# EAGLE schematic uArm_back_print (EAGLE 9.5.1)
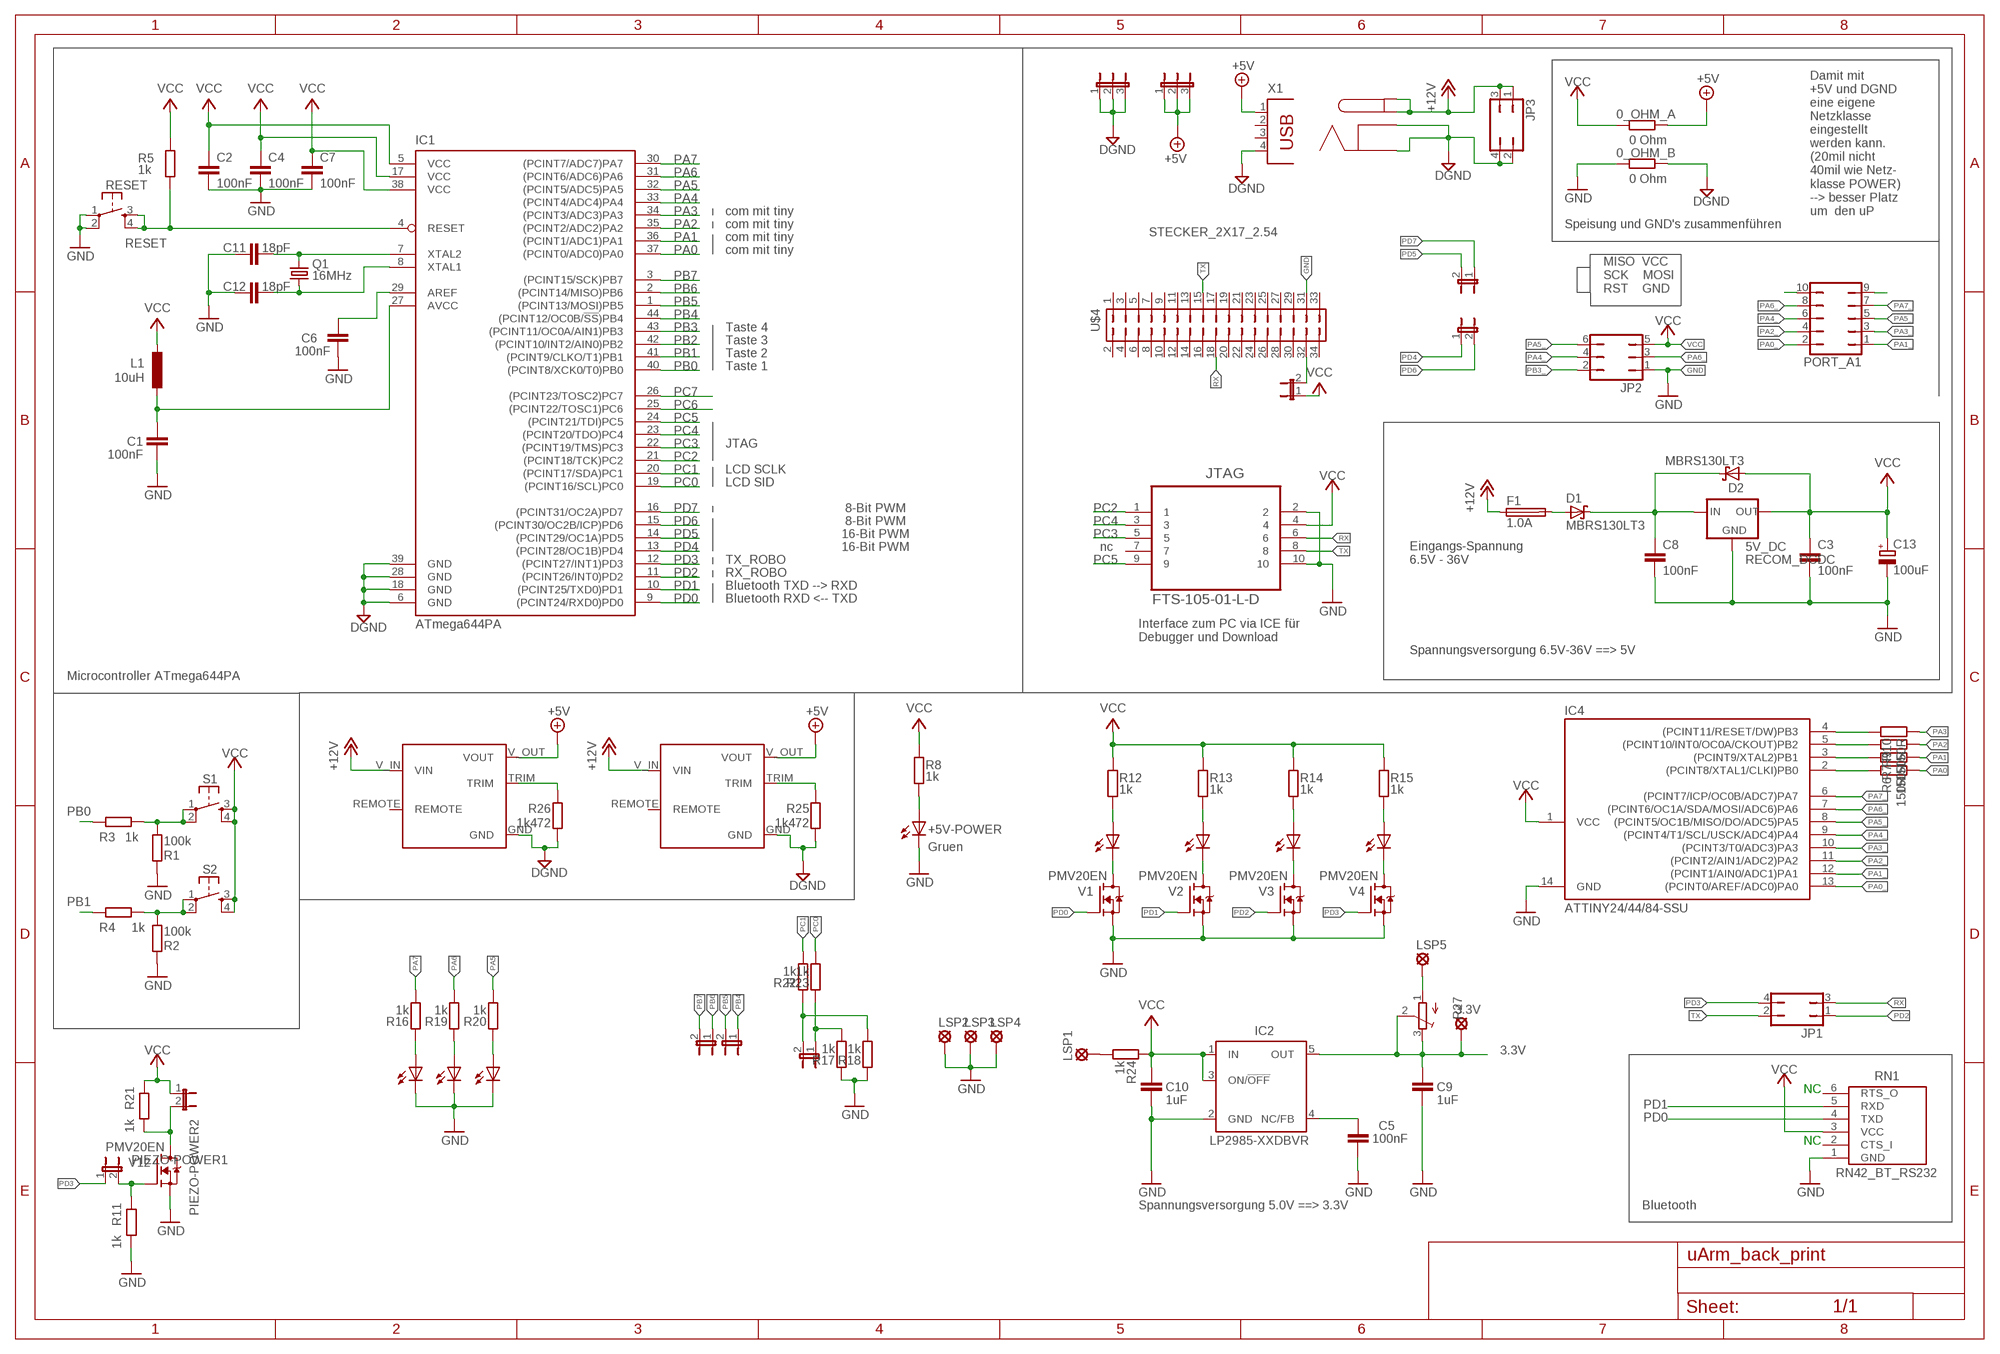
[diagram p0: schematic, sheet 1]

## Parts
0_OHM_A  0 Ohm  R-EU_R0805  [R0805]
0_OHM_B  0 Ohm  R-EU_R0805  [R0805]
3.3V  3.3V  LSP11  [LSP11]
5V_DC  RECOM_DCDC  [RECOM_DCDC]
+5V-POWER  Gruen  LEDCHIPLED_1206  [CHIPLED_1206]
C1  100nF  C-EUC0805  [C0805]
C2  100nF  C-EUC0805  [C0805]
C3  100nF  C-EUC0805  [C0805]
C4  100nF  C-EUC0805  [C0805]
C5  100nF  C-EUC0805  [C0805]
C6  100nF  C-EUC0805  [C0805]
C7  100nF  C-EUC0805  [C0805]
C8  100nF  C-EUC0805  [C0805]
C9  1uF  C-EUC0805  [C0805]
C10  1uF  C-EUC0805  [C0805]
C11  18pF  C-EUC0805  [C0805]
C12  18pF  C-EUC0805  [C0805]
C13  100uF  CPOL-EUUD-6,3X8,8  [UD-6,3X5,8_NICHICON]
D1  MBRS130LT3  [SMB]
D2  MBRS130LT3  [SMB]
F1  1.0A  195601206  [F1206]
IC1  ATmega644PA  ATMEGA644A  [TQFP44]
IC2  LP2985-XXDBVR  [SOT23-DBV]
IC4  ATTINY24/44/84-SSU  [SOIC14]
JP1  JP2Q  [JP2Q]
JP2  JP3Q  [JP3Q]
JP3  JP2Q  [JP2Q]
JTAG  FTS-105-01-L-D  [SAMTEC_FTS-105-01-L-D]
L1  10uH  L-EUL2825P  [L2825P]
LSP1  LSP11  [LSP11]
LSP2  LSP11  [LSP11]
LSP3  LSP11  [LSP11]
LSP4  LSP11  [LSP11]
LSP5  LSP11  [LSP11]
PIEZO-POWER1  JP1E  [JP1]
PIEZO-POWER2  JP1E  [JP1]
PIEZO-POWER3  JP1E  [JP1]
PIEZO-POWER4  JP1E  [JP1]
PIEZO-POWER5  JP1E  [JP1]
PIEZO-POWER8  JP1E  [JP1]
PIEZO-POWER9  JP1E  [JP1]
PIEZO-POWER10  JP1E  [JP1]
PORT_A1  JP5Q  [JP5Q]
Q1  16MHz  CRYSTALHC49UP  [HC49UP]
R1  100k  R-EU_R0805  [R0805]
R2  100k  R-EU_R0805  [R0805]
R3  1k  R-EU_R0805  [R0805]
R4  1k  R-EU_R0805  [R0805]
R5  1k  R-EU_R0805  [R0805]
R6  150R  R-EU_R0805  [R0805]
R7  150R  R-EU_R0805  [R0805]
R8  1k  R-EU_R0805  [R0805]
R9  150R  R-EU_R0805  [R0805]
R10  150R  R-EU_R0805  [R0805]
R11  1k  R-EU_R0805  [R0805]
R12  1k  R-EU_R0805  [R0805]
R13  1k  R-EU_R0805  [R0805]
R14  1k  R-EU_R0805  [R0805]
R15  1k  R-EU_R0805  [R0805]
R16  1k  R-EU_R0805  [R0805]
R17  1k  R-EU_R0805  [R0805]
R18  1k  R-EU_R0805  [R0805]
R19  1k  R-EU_R0805  [R0805]
R20  1k  R-EU_R0805  [R0805]
R21  1k  R-EU_R0805  [R0805]
R22  1k  R-EU_R0805  [R0805]
R23  1k  R-EU_R0805  [R0805]
R24  1k  R-EU_R0805  [R0805]
R25  1k472  R-EU_R0805  [R0805]
R26  1k472  R-EU_R0805  [R0805]
R27  TRIM_EU-3223G  [3223G]
RESET  TS42_4PAD  [TS42_4PAD]
RN1  RN42_BT_RS232  [RN42BT_RS232]
RX1  Gruen  LEDCHIPLED_1206  [CHIPLED_1206]
RX2  Gruen  LEDCHIPLED_1206  [CHIPLED_1206]
S1  TS42_4PAD  [TS42_4PAD]
S2  TS42_4PAD  [TS42_4PAD]
TX1  Gruen  LEDCHIPLED_1206  [CHIPLED_1206]
TX2  Gruen  LEDCHIPLED_1206  [CHIPLED_1206]
TX3  Gruen  LEDCHIPLED_1206  [CHIPLED_1206]
TX4  Gruen  LEDCHIPLED_1206  [CHIPLED_1206]
TX5  Gruen  LEDCHIPLED_1206  [CHIPLED_1206]
U$1  BUCHSE  [BUCHSE]
U$2  DCDC  [1X2,3_2.54MM]
U$3  DCDC  [1X2,3_2.54MM]
U$4  STECKER_2X17_2.54  [2X17_2.54]
UART_ROBO1  JP2E  [JP2]
UART_ROBO2  JP2E  [JP2]
V1  PMV20EN  BSS138  [SOT23]
V2  PMV20EN  BSS138  [SOT23]
V3  PMV20EN  BSS138  [SOT23]
V4  PMV20EN  BSS138  [SOT23]
V12  PMV20EN  BSS138  [SOT23]
X1  PN87520  [PN87520]

## Nets
3.3V: 3.3V.MP C9.1 IC2.5(OUT) R27.2(S) R27.3(E)
+5V: 0_OHM_A.2 U$2.V_OUT(VOUT) U$3.V_OUT(VOUT) UART_ROBO1.1 UART_ROBO1.2 UART_ROBO1.3 X1.1
+12V: F1.1 JP3.1 JP3.3 U$1.3 U$1.3.1 U$2.V_IN(VIN) U$3.V_IN(VIN)
DGND: 0_OHM_B.2 IC1.6(GND) IC1.18(GND) IC1.28(GND) IC1.39(GND) JP3.2 JP3.4 R25.1 R26.1 U$1.1 U$1.2 U$2.GND U$3.GND UART_ROBO2.1 UART_ROBO2.2 UART_ROBO2.3 X1.4
GND: 0_OHM_B.1 5V_DC.GND +5V-POWER.C C1.1 C2.2 C3.2 C4.2 C5.2 C6.1 C7.2 C8.2 C9.2 C10.2 C11.1 C12.2 C13.- IC2.2(GND) IC4.14(GND) JP2.1 JTAG.2 JTAG.10 LSP2.MP LSP3.MP LSP4.MP R1.1 R2.1 R11.2 R17.2 R18.2 RESET.1 RESET.2 RN1.1(GND) TX3.C TX4.C TX5.C U$4.31 V1.2(S) V2.2(S) V3.2(S) V4.2(S) V12.2(S)
N$1: PIEZO-POWER4.2 U$4.32
N$2: TX1.C V2.3(D)
N$3: RX1.C V1.3(D)
N$4: R13.1 TX1.A
N$5: R12.1 RX1.A
N$6: R16.2 TX5.A
N$7: R19.2 TX4.A
N$8: RX2.C V4.3(D)
N$9 [POWER]: D1.A F1.2
N$10: R15.1 RX2.A
N$11: R14.1 TX2.A
N$12: TX2.C V3.3(D)
N$13: R20.2 TX3.A
N$14: PIEZO-POWER10.2 R18.1 R22.2
N$15: PIEZO-POWER10.1 R17.1 R23.2
N$16: R26.2 U$3.TRIM
N$17: LSP5.MP R27.1(A)
N$18: LSP1.MP R24.1
N$21: R1.2 R3.2 S1.1 S1.2
N$22: R2.2 R4.2 S2.1 S2.2
N$27: PORT_A1.9
N$28: PORT_A1.10
N$35: C1.2 IC1.27(AVCC) L1.2
N$36: C12.1 IC1.8(XTAL1) Q1.1
N$37: C11.2 IC1.7(XTAL2) Q1.2
N$38: C6.2 IC1.29(AREF)
N$46: PIEZO-POWER2.2 R21.2 V12.3(D)
N$60: +5V-POWER.A R8.1
N$70: C5.1 IC2.4(NC/FB)
N$75 [POWER]: 5V_DC.IN C8.1 D1.C D2.C
N$85: R25.2 U$2.TRIM
PA0: IC1.37((PCINT0/ADC0)PA0) R6.1
PA0_: IC4.13((PCINT0/AREF/ADC0)PA0) PORT_A1.2
PA1: IC1.36((PCINT1/ADC1)PA1) R7.1
PA1_: IC4.12((PCINT1/AIN0/ADC1)PA1) PORT_A1.1
PA2: IC1.35((PCINT2/ADC2)PA2) R9.1
PA2_: IC4.11((PCINT2/AIN1/ADC2)PA2) PORT_A1.4
PA3: IC1.34((PCINT3/ADC3)PA3) R10.1
PA3_: IC4.10((PCINT3/T0/ADC3)PA3) PORT_A1.3
PA4: IC1.33((PCINT4/ADC4)PA4)
PA4_: IC4.9((PCINT4/T1/SCL/USCK/ADC4)PA4) JP2.4 PORT_A1.6
PA5: IC1.32((PCINT5/ADC5)PA5) R20.1
PA5_: IC4.8((PCINT5/OC1B/MISO/DO/ADC5)PA5) JP2.6 PORT_A1.5
PA6: IC1.31((PCINT6/ADC6)PA6) R19.1
PA6_: IC4.7((PCINT6/OC1A/SDA/MOSI/ADC6)PA6) JP2.3 PORT_A1.8
PA7: IC1.30((PCINT7/ADC7)PA7) R16.1
PA7_: IC4.6((PCINT7/ICP/OC0B/ADC7)PA7) PORT_A1.7
PB0: IC1.40((PCINT8/XCK0/T0)PB0) R3.1
PB0_: IC4.2((PCINT8/XTAL1/CLKI)PB0) R6.2
PB1: IC1.41((PCINT9/CLKO/T1)PB1) R4.1
PB1_: IC4.3((PCINT9/XTAL2)PB1) R7.2
PB2: IC1.42((PCINT10/INT2/AIN0)PB2)
PB2_: IC4.5((PCINT10/INT0/OC0A/CKOUT)PB2) R9.2
PB3: IC1.43((PCINT11/OC0A/AIN1)PB3)
PB3_: IC4.4((PCINT11/RESET/DW)PB3) JP2.2 R10.2
PB4: IC1.44((PCINT12/OC0B/!SS!)PB4) PIEZO-POWER9.1
PB5: IC1.1((PCINT13/MOSI)PB5) PIEZO-POWER9.2
PB6: IC1.2((PCINT14/MISO)PB6) PIEZO-POWER8.1
PB7: IC1.3((PCINT15/SCK)PB7) PIEZO-POWER8.2
PC0: IC1.19((PCINT16/SCL)PC0) R23.1
PC1: IC1.20((PCINT17/SDA)PC1) R22.1
PC2: IC1.21((PCINT18/TCK)PC2) JTAG.1
PC3: IC1.22((PCINT19/TMS)PC3) JTAG.5
PC4: IC1.23((PCINT20/TDO)PC4) JTAG.3
PC5: IC1.24((PCINT21/TDI)PC5) JTAG.9
PC6: IC1.25((PCINT22/TOSC1)PC6)
PC7: IC1.26((PCINT23/TOSC2)PC7)
PD0: IC1.9((PCINT24/RXD0)PD0) RN1.4(TXD) V1.1(G)
PD1: IC1.10((PCINT25/TXD0)PD1) RN1.5(RXD) V2.1(G)
PD2: IC1.11((PCINT26/INT0)PD2) JP1.1 V3.1(G)
PD3: IC1.12((PCINT27/INT1)PD3) JP1.4 PIEZO-POWER1.1 V4.1(G)
PD4: IC1.13((PCINT28/OC1B)PD4) PIEZO-POWER3.1
PD5: IC1.14((PCINT29/OC1A)PD5) PIEZO-POWER5.2
PD6: IC1.15((PCINT30/OC2B/ICP)PD6) PIEZO-POWER3.2
PD7: IC1.16((PCINT31/OC2A)PD7) PIEZO-POWER5.1
PD8: PIEZO-POWER1.2 R11.1 V12.1(G)
RESET: IC1.4(RESET) R5.1 RESET.3 RESET.4
RX: JP1.3 JTAG.6 U$4.18
TX: JP1.2 JTAG.8 U$4.15
VCC: 0_OHM_A.1 5V_DC.OUT C2.1 C3.1 C4.1 C7.1 C10.1 C13.+ D2.A IC1.5(VCC) IC1.17(VCC) IC1.38(VCC) IC2.1(IN) IC2.3(ON/!OFF) IC4.1(VCC) JP2.5 JTAG.4 L1.1 PIEZO-POWER2.1 PIEZO-POWER4.1 R5.2 R8.2 R12.2 R13.2 R14.2 R15.2 R21.1 R24.2 RN1.3(VCC) S1.3 S1.4 S2.3 S2.4
Unconnected: JTAG.7 RN1.2(CTS_I) RN1.6(RTS_O) U$2.REMOTE U$3.REMOTE U$4.1 U$4.2 U$4.3 U$4.4 U$4.5 U$4.6 U$4.7 U$4.8 U$4.9 U$4.10 U$4.11 U$4.12 U$4.13 U$4.14 U$4.16 U$4.17 U$4.19 U$4.20 U$4.21 U$4.22 U$4.23 U$4.24 U$4.25 U$4.26 U$4.27 U$4.28 U$4.29 U$4.30 U$4.33 U$4.34 X1.2 X1.3

## Notes on the sheet
- com mit tiny
- Damit mit
  +5V und DGND
  eine eigene 
  Netzklasse
  eingestellt
  werden kann.
  (20mil nicht
  40mil wie Netz-
  klasse POWER)
  --> besser Platz 
  um  den uP
- com mit tiny | Speisung und GND's zusammenführen
- com mit tiny
- com mit tiny
- MISO  VCC
  SCK    MOSI
  RST    GND
- Taste 4
- Taste 3
- Taste 2
- Taste 1
- JTAG
- LCD SCLK
- LCD SID
- 8-Bit PWM
- 8-Bit PWM
- 16-Bit PWM
- 16-Bit PWM | nc
- TX_ROBO
- Eingangs-Spannung
  6.5V - 36V
- RX_ROBO
- Bluetooth TXD --> RXD
- Bluetooth RXD <-- TXD
- Interface zum PC via ICE für
  Debugger und Download
- Spannungsversorgung 6.5V-36V ==> 5V
- Microcontroller ATmega644PA
- NC
- NC
- Spannungsversorgung 5.0V ==> 3.3V | Bluetooth

## Library data of the parts
0_OHM_A 0_OHM_B R1-R26 = rcl:R-EU_: RESISTOR, European symbol; SPICEPREFIX: R
3.3V LSP1-LSP5 = solpad:LSP11: SOLDER PAD drill 1.1 mm
5V_DC = DCDC:RECOM_DCDC
+5V-POWER RX1 RX2 TX1-TX5 = led:LED: LED OSRAM: - CHIPLED LG R971, LG N971, LY N971, LG Q971, LY Q971, LO R971, LY R971 LH N974, LH R974 LS Q976, LO Q976, LY Q976 LO Q996 - Hyper CHIPLED LW Q18S LB Q993, LB Q99A, LB R99A - SideLED LS A670, LO A670, LY A670, LG A670, LP A670 LB A673, LV A673, LT A673, LW A673 LH A674 LY A675 LS A676, LA A676, LO A676, LY A676, LW A676 LS A679, LY A679, LG A679 - Hyper Micro SIDELED® LS Y876, LA Y876, LO Y876, LY Y876 LT Y87S - SmartLED LW L88C, LW L88S LB L89C, LB L89S, LG L890 LS L89K, LO L89K, LY L89K LS L896, LA L896, LO L896, LY L896 - TOPLED LS T670, LO T670, LY T670, LG T670, LP T670 LSG T670, LSP T670, LSY T670, LOP T670, LYG T670 LG T671, LOG T671, LSG T671 LB T673, LV T673, LT T673, LW T673 LH T674 LS T676, LA T676, LO T676, LY T676, LB T676, LH T676, LSB T676, LW T676 LB T67C, LV T67C, LT T67C, LS T67K, LO T67K, LY T67K, LW E67C LS E67B, LA E67B, LO E67B, LY E67B, LB E67C, LV E67C, LT E67C LW T67C LS T679, LY T679, LG T679 LS T770, LO T770, LY T770, LG T770, LP T770 LB T773, LV T773, LT T773, LW T773 LH T774 LS E675, LA E675, LY E675, LS T675 LS T776, LA T776, LO T776, LY T776, LB T776 LHGB T686 LT T68C, LB T68C - Hyper Mini TOPLED® LB M676 - Mini TOPLED Santana® LG M470 LS M47K, LO M47K, LY M47K Source: http://www.osram.convergy.de LUXEON: - LUMILED® LXK2-PW12-R00, LXK2-PW12-S00, LXK2-PW14-U00, LXK2-PW14-V00 LXK2-PM12-R00, LXK2-PM12-S00, LXK2-PM14-U00 LXK2-PE12-Q00, LXK2-PE12-R00, LXK2-PE12-S00, LXK2-PE14-T00, LXK2-PE14-U00 LXK2-PB12-K00, LXK2-PB12-L00, LXK2-PB12-M00, LXK2-PB14-N00, LXK2-PB14-P00, LXK2-PB14-Q00 LXK2-PR12-L00, LXK2-PR12-M00, LXK2-PR14-Q00, LXK2-PR14-R00 LXK2-PD12-Q00, LXK2-PD12-R00, LXK2-PD12-S00 LXK2-PH12-R00, LXK2-PH12-S00 LXK2-PL12-P00, LXK2-PL12-Q00, LXK2-PL12-R00 Source: www.luxeon.com KINGBRIGHT: KA-3528ASYC Source: www.kingbright.com
C1-C12 = rcl:C-EU: CAPACITOR, European symbol; SPICEPREFIX: C
C13 = rcl2:CPOL-EU: POLARIZED CAPACITOR, European symbol
D1 D2 = diode:MBRS130LT3: Schottky Power Rectifier Source: http://www.onsemi.com/pub/Collateral/MBRS130LT3-D.PDF
F1 = fuse:19560: FUSE HOLDER TR5, Wickmann
IC1 = atmel:ATMEGA644: 8-bit Microcontroller with 64K Bytes In-System Programmable Flash Source: http://www.atmel.com/dyn/resources/prod_documents/doc2593.pdf; MPN: ATMEGA644PV-10AU; OC_FARNELL: 1455123; OC_NEWARK: 58M3748
IC2 = SmartPrj:LP2985-XXDBVR: ULTRALOW-POWER 50-mA LOW-DROPOUT LINEAR REGULATORS 50-mA Low-Dropout Regulator Source: http://focus.ti.com/lit/ds/symlink/tps77001.pdf
IC4 = attiny24_44_84:ATTINY24/44/84
JP1 JP3 = jumper:JP2Q: JUMPER
JP2 = jumper:JP3Q: JUMPER
JTAG = JTAG_10pol_50mil:FTS-105-01-L-D; DESCRIPTION: CONN HEADER, 1.27MM, THRU HOLE, 10WAY; MPN: FTS-105-01-L-D; OCFARNELL: 1667728; OCNEWARK: 11P4652; PACKAGE: HEADER, 1.27MM, THRU HOLE, 10WAY; SUPPLIER: Samtec
L1 = rcl:L-EU: INDUCTOR, European symbol
PIEZO-POWER1-PIEZO-POWER5 PIEZO-POWER8-PIEZO-POWER10 = jumper:JP1E: JUMPER
PORT_A1 = jumper:JP5Q: JUMPER
Q1 = crystal:CRYSTAL: CRYSTAL; OC_FARNELL: unknown; OC_NEWARK: unknown
R27 = pot:TRIM_EU-: POTENTIOMETER
RESET S1 S2 = SmartPrj:TS42_4PAD
RN1 = RN42_BT_RS232:RN42_BT_RS232
U$1 = untitled:BUCHSE
U$2 U$3 = untitled:DCDC
U$4 = untitled:STECKER_2X17_2.54
UART_ROBO1 UART_ROBO2 = jumper:JP2E: JUMPER
V1-V4 V12 = transistor-fet-mit-BSS138:BSS138
X1 = con-berg:PN87520: BERG USB connector; OC_FARNELL: unknown; OC_NEWARK: unknown

## Net classes
0 default: width 0.254 mm, drill 0.508 mm
1 POWER: width 1.016 mm, drill 1.016 mm